# EAGLE schematic ExpositionTest (EAGLE 6.1)
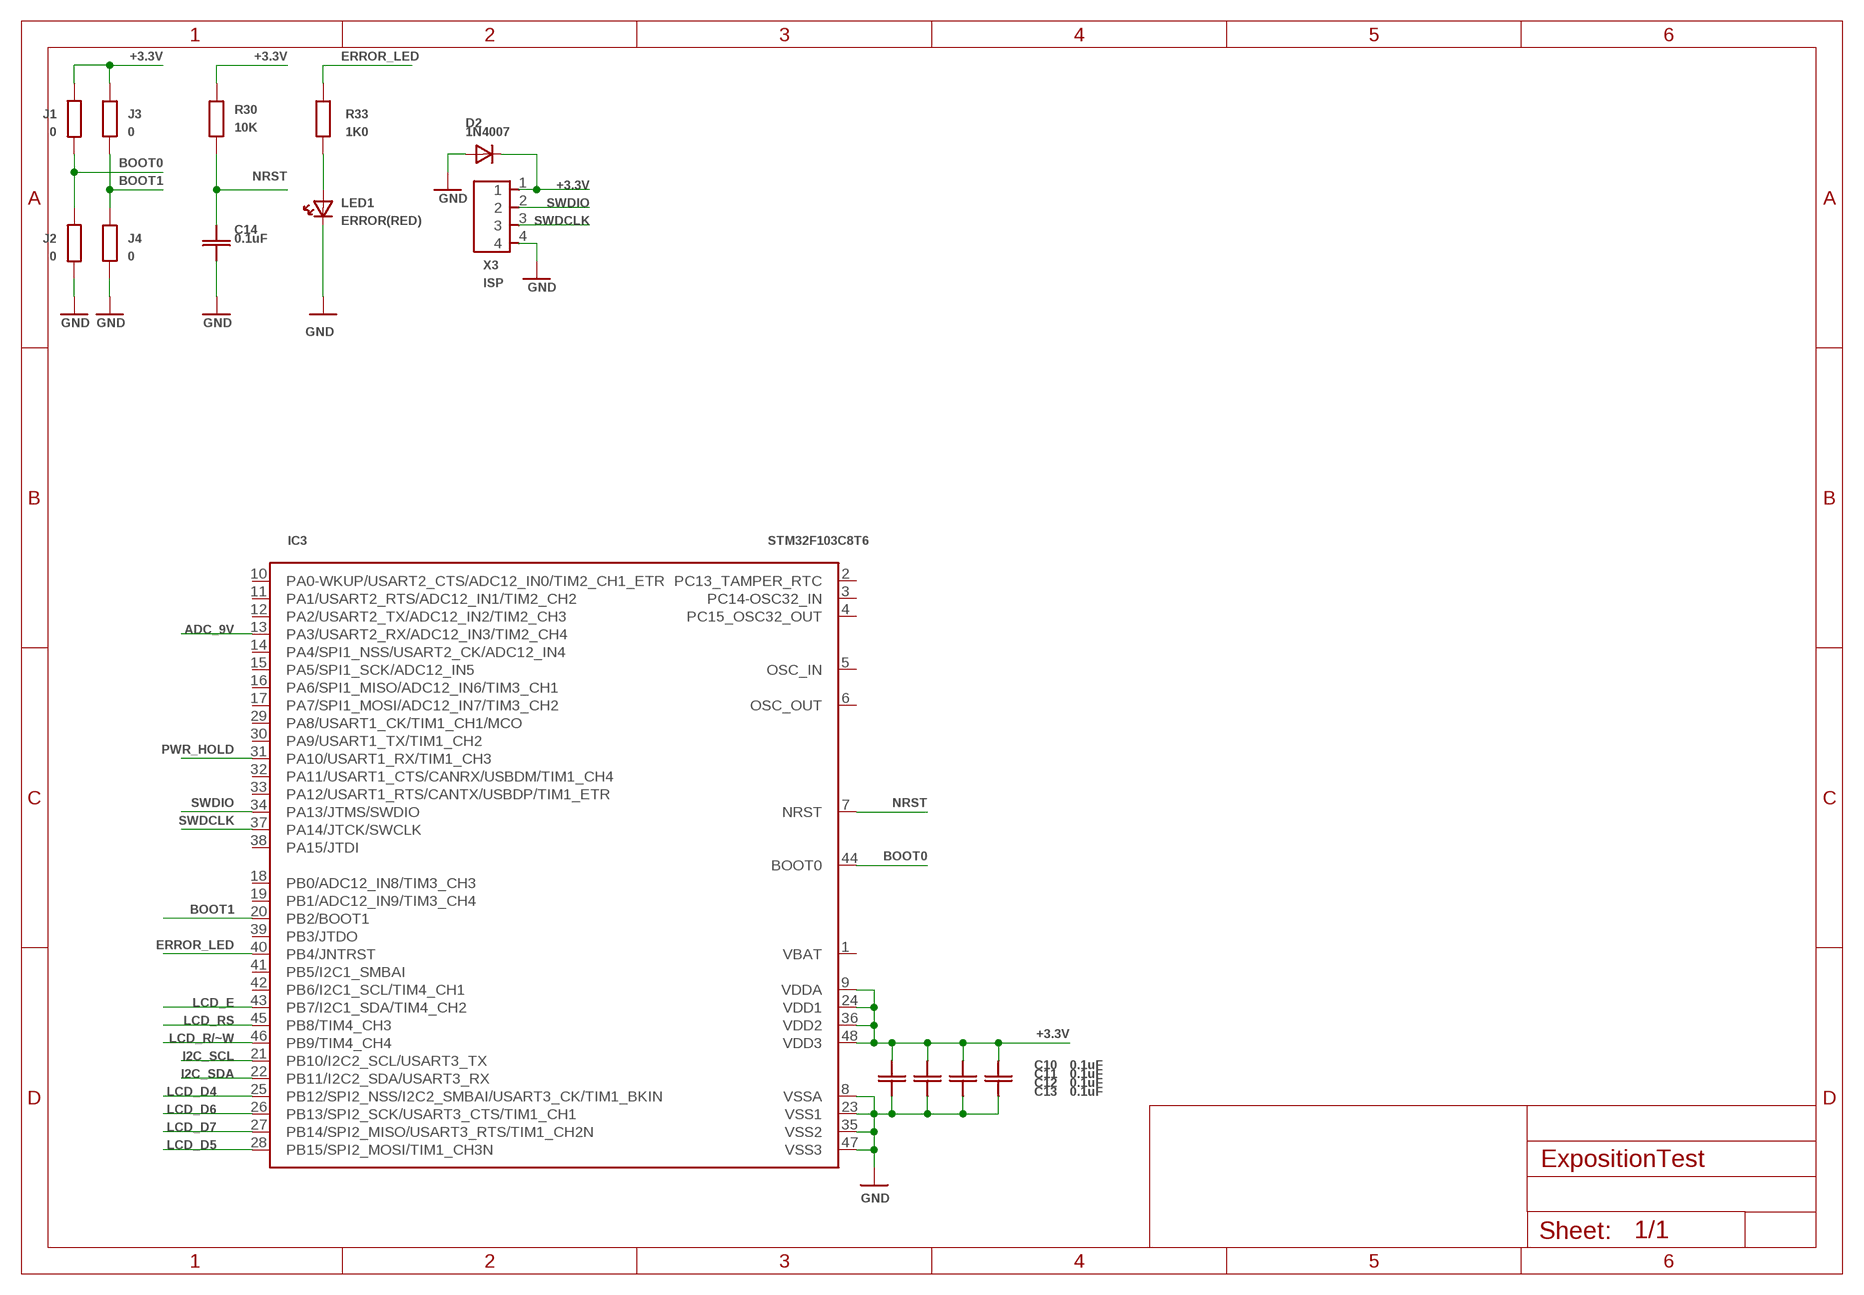
[diagram p0: schematic, sheet 1]

## Parts
C10  0.1uF  CSMD_0805  [RSMD_0805]
C11  0.1uF  CSMD_0805  [RSMD_0805]
C12  0.1uF  CSMD_0805  [RSMD_0805]
C13  0.1uF  CSMD_0805  [RSMD_0805]
C14  0.1uF  CSMD_0805  [RSMD_0805]
D2  1N4007  1N4001DO-41_10MM  [DO-41_10MM]
IC3  STM32F103C8T6  STM32F103C8T6(LQFP48)(LQFP48)  [LQFP48]
J1  0  RSMD_0805  [RSMD_0805]
J2  0  RSMD_0805  [RSMD_0805]
J3  0  RSMD_0805  [RSMD_0805]
J4  0  RSMD_0805  [RSMD_0805]
LED1  ERROR(RED)  LED3MM(SMD0805)  [LED_0805]
R30  10K  RSMD_0805  [RSMD_0805]
R33  1K0  RSMD_0805  [RSMD_0805]
X3  ISP  PIN4X1(2.54MM)  [PIN4X1_2.54MM]

## Nets
+3.3V: C10.PAD_1(PIN1) C11.PAD_1(PIN1) C12.PAD_1(PIN1) C13.PAD_1(PIN1) D2.CATHODE IC3.9(VDDA) IC3.24(VDD1) IC3.36(VDD2) IC3.48(VDD3) J1.PAD_0(PIN0) J3.PAD_0(PIN0) R30.PAD_0(PIN0) X3.1
ADC_9V: IC3.13(PA3/USART2_RX/ADC12_IN3/TIM2_CH4)
BOOT0: IC3.44(BOOT0) J1.PAD_1(PIN1) J2.PAD_0(PIN0)
BOOT1: IC3.20(PB2/BOOT1) J3.PAD_1(PIN1) J4.PAD_0(PIN0)
ERROR_LED: IC3.40(PB4/JNTRST) R33.PAD_0(PIN0)
GND: C10.PAD_0(PIN0) C11.PAD_0(PIN0) C12.PAD_0(PIN0) C13.PAD_0(PIN0) C14.PAD_0(PIN0) D2.ANODE IC3.8(VSSA) IC3.23(VSS1) IC3.35(VSS2) IC3.47(VSS3) J2.PAD_1(PIN1) J4.PAD_1(PIN1) LED1.CATHODE X3.4
I2C_SCL: IC3.21(PB10/I2C2_SCL/USART3_TX)
I2C_SDA: IC3.22(PB11/I2C2_SDA/USART3_RX)
LCD_D4: IC3.25(PB12/SPI2_NSS/I2C2_SMBAI/USART3_CK/TIM1_BKIN)
LCD_D5: IC3.28(PB15/SPI2_MOSI/TIM1_CH3N)
LCD_D6: IC3.26(PB13/SPI2_SCK/USART3_CTS/TIM1_CH1)
LCD_D7: IC3.27(PB14/SPI2_MISO/USART3_RTS/TIM1_CH2N)
LCD_E: IC3.43(PB7/I2C1_SDA/TIM4_CH2)
LCD_R/~W: IC3.46(PB9/TIM4_CH4)
LCD_RS: IC3.45(PB8/TIM4_CH3)
N$19: LED1.ANODE R33.PAD_1(PIN1)
NRST: C14.PAD_1(PIN1) IC3.7(NRST) R30.PAD_1(PIN1)
PWR_HOLD: IC3.31(PA10/USART1_RX/TIM1_CH3)
SWDCLK: IC3.37(PA14/JTCK/SWCLK) X3.3
SWDIO: IC3.34(PA13/JTMS/SWDIO) X3.2
Unconnected: IC3.1(VBAT) IC3.2(PC13_TAMPER_RTC) IC3.3(PC14-OSC32_IN) IC3.4(PC15_OSC32_OUT) IC3.5(OSC_IN) IC3.6(OSC_OUT) IC3.10(PA0-WKUP/USART2_CTS/ADC12_IN0/TIM2_CH1_ETR) IC3.11(PA1/USART2_RTS/ADC12_IN1/TIM2_CH2) IC3.12(PA2/USART2_TX/ADC12_IN2/TIM2_CH3) IC3.14(PA4/SPI1_NSS/USART2_CK/ADC12_IN4) IC3.15(PA5/SPI1_SCK/ADC12_IN5) IC3.16(PA6/SPI1_MISO/ADC12_IN6/TIM3_CH1) IC3.17(PA7/SPI1_MOSI/ADC12_IN7/TIM3_CH2) IC3.18(PB0/ADC12_IN8/TIM3_CH3) IC3.19(PB1/ADC12_IN9/TIM3_CH4) IC3.29(PA8/USART1_CK/TIM1_CH1/MCO) IC3.30(PA9/USART1_TX/TIM1_CH2) IC3.32(PA11/USART1_CTS/CANRX/USBDM/TIM1_CH4) IC3.33(PA12/USART1_RTS/CANTX/USBDP/TIM1_ETR) IC3.38(PA15/JTDI) IC3.39(PB3/JTDO) IC3.41(PB5/I2C1_SMBAI) IC3.42(PB6/I2C1_SCL/TIM4_CH1)

## Library data of the parts
C10-C14 = __MyCommonLib1:C
D2 = __MyCommonLib1:1N4001
IC3 = __MyCommonLib1:STM32F103C8T6(LQFP48)
J1-J4 R30 R33 = __MyCommonLib1:R
LED1 = __MyCommonLib1:LED3MM
X3 = __MyCommonLib1:PIN4X1